# Altium schematic sheet Schem_Analog_2021-08-04.schdoc
size 290 x 200 mm
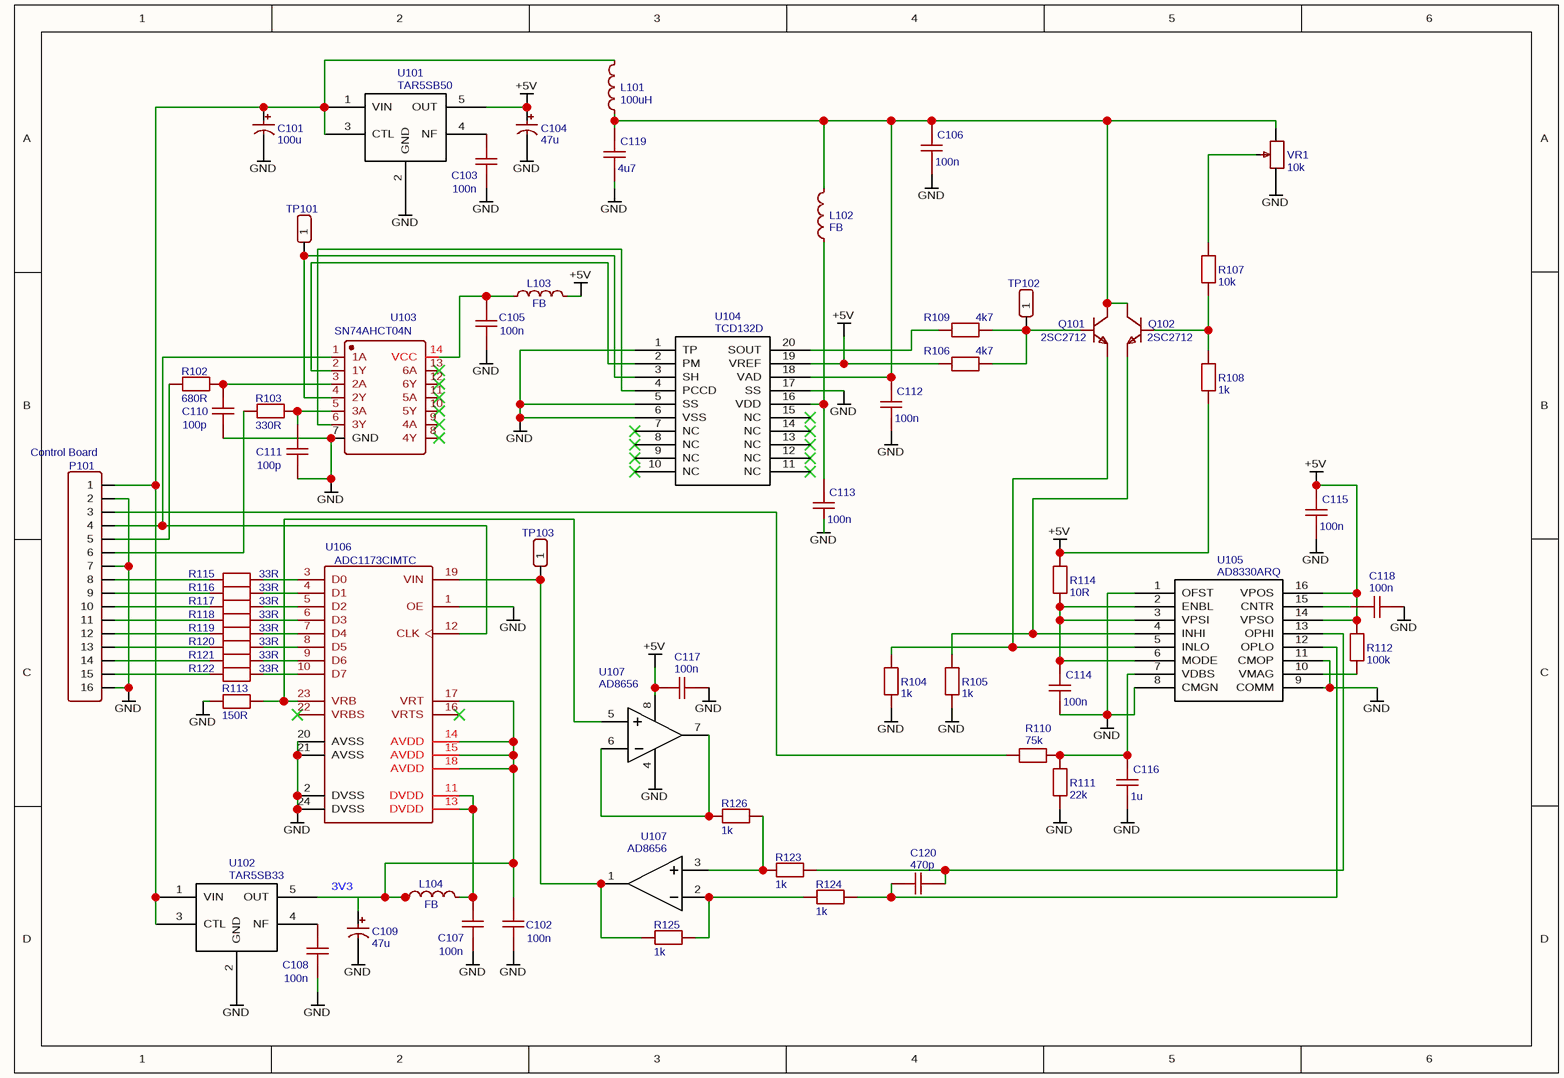
[diagram p0: Schem_Analog_2021-08-04.schdoc]

## Parts
(Parts that share a designator on the sheet are numbered #1, #2 ... from top to bottom, then left to right.)
C101  100u  [CAP-TH_BD5.0-P2.00-D0.8-FD]
C102  100n  [RAD-0.1]
C103  100n  [RAD-0.1]
C104  47u  [CAP-TH_BD5.0-P2.00-D0.8-FD]
C105  100n  [RAD-0.1]
C106  100n  [RAD-0.1]
C107  100n  [RAD-0.1]
C108  100n  [RAD-0.1]
C109  47u  [CAP-TH_BD5.0-P2.00-D0.8-FD]
C110  100p  [RAD-0.1]
C111  100p  [RAD-0.1]
C112  100n  [RAD-0.1]
C113  100n  [RAD-0.1]
C114  100n  [RAD-0.1]
C115  100n  [RAD-0.1]
C116  1u  [RAD-0.1]
C117  100n  [RAD-0.1]
C118  100n  [RAD-0.1]
C119  4u7  [RAD-0.1]
C120  470p  [RAD-0.1]
L101  100uH  [IND-TH_BD8.5-P5.00-D0.6]
L102  FB  [L0603]
L103  FB  [L0603]
L104  FB  [L0603]
P101  Control Board  [HDR-TH_16P-P2.54-V]
Q101  2SC2712  [SOT-23-3_L2.9-W1.6-P1.90-LS2.8-BR]
Q102  2SC2712  [SOT-23-3_L2.9-W1.6-P1.90-LS2.8-BR]
R102  680R  [R_AXIAL-0.3]
R103  330R  [R_AXIAL-0.3]
R104  1k  [R_AXIAL-0.3]
R105  1k  [R_AXIAL-0.3]
R106  4k7  [R_AXIAL-0.3]
R107  10k  [R_AXIAL-0.3]
R108  1k  [R_AXIAL-0.3]
R109  4k7  [R_AXIAL-0.3]
R110  75k  [R_AXIAL-0.3]
R111  22k  [R_AXIAL-0.3]
R112  100k  [R_AXIAL-0.3]
R113  150R  [R_AXIAL-0.3]
R114  10R  [R_AXIAL-0.3]
R115  33R  [R_AXIAL-0.3]
R116  33R  [R_AXIAL-0.3]
R117  33R  [R_AXIAL-0.3]
R118  33R  [R_AXIAL-0.3]
R119  33R  [R_AXIAL-0.3]
R120  33R  [R_AXIAL-0.3]
R121  33R  [R_AXIAL-0.3]
R122  33R  [R_AXIAL-0.3]
R123  1k  [R_AXIAL-0.3]
R124  1k  [R_AXIAL-0.3]
R125  1k  [R_AXIAL-0.3]
R126  1k  [R_AXIAL-0.3]
TP101  HDR-M-2.54_1x1  [HDR-M-2.54_1X1]  (value not drawn)
TP102  HDR-M-2.54_1x1  [HDR-M-2.54_1X1]  (value not drawn)
TP103  HDR-M-2.54_1x1  [HDR-M-2.54_1X1]  (value not drawn)
U101  TAR5SB50  [SOT23-5]
U102  TAR5SB33  [SOT23-5]
U103  SN74AHCT04N  [DIP14]
U104  TCD132D  [WDIP20-G-400(B)]
U105  AD8330ARQ  [AD8330-RQ_16]
U106  ADC1173CIMTC  [TSSOP-24]
U107#1  AD8656  [ADI-R-8_N]
U107#2  AD8656  [ADI-R-8_N]
VR1  10k  [RES-ADJ-TH_3296W]

## Nets
+5V: C104.1 C115.1 C117.1 L103.2 R106.1 R108.1 R112.1 R114.1 U101.5(OUT) U104.19(VREF) U105.14(VPSO) U105.16(VPOS) U107#1.8(+V)
GND: C101.2 C102.2 C103.2 C104.2 C105.2 C106.2 C107.2 C108.2 C109.2 C110.2 C111.2 C112.2 C113.2 C114.2 C115.2 C116.2 C117.2 C118.2 C119.2 P101.2 P101.7 P101.16 R104.2 R105.2 R111.2 R113.2 U101.2(GND) U102.2(GND) U103.7(GND) U104.1(TP) U104.5(SS) U104.6(VSS) U104.17(SS) U105.1(OFST) U105.8(CMGN) U105.9(COMM) U105.11(CMOP) U106.1(OE) U106.2(DVSS) U106.20(AVSS) U106.21(AVSS) U106.24(DVSS) U107#1.4(-V) VR1.3
NetC101_1: C101.1 L101.2 P101.1 U101.1(VIN) U101.3(CTL) U102.1(VIN) U102.3(CTL)
NetC102_1: C102.1 C109.1 L104.1 U102.5(OUT) U106.14(AVDD) U106.15(AVDD) U106.17(VRT) U106.18(AVDD)
NetC103_1: C103.1 U101.4(NF)
NetC105_1: C105.1 L103.1 U103.14(VCC)
NetC106_1: C106.1 C112.1 C119.1 L101.1 L102.2 Q101.3(C) Q102.3(C) U104.18(VAD) VR1.1
NetC107_1: C107.1 L104.2 U106.11(DVDD) U106.13(DVDD)
NetC108_1: C108.1 U102.4(NF)
NetC110_1: C110.1 R102.1 U103.3(2A)
NetC111_1: C111.1 R103.1 U103.5(3A)
NetC113_1: C113.1 L102.1 U104.16(VDD)
NetC114_1: C114.1 R114.2 U105.2(ENBL) U105.3(VPSI) U105.6(MODE)
NetC116_1: C116.1 R110.2 R111.1 U105.7(VDBS)
NetC118_1: C118.1 U105.15(CNTR)
NetC120_1: C120.1 R124.1 U105.12(OPLO)
NetC120_2: C120.2 R123.1 U105.13(OPHI)
NetP101_3: P101.3 R110.1
NetP101_4: P101.4 U103.1(1A) U106.12(CLK)
NetP101_5: P101.5 R102.2
NetP101_6: P101.6 R103.2
NetP101_8: P101.8 R115.2
NetP101_9: P101.9 R116.2
NetP101_10: P101.10 R117.2
NetP101_11: P101.11 R118.2
NetP101_12: P101.12 R119.2
NetP101_13: P101.13 R120.2
NetP101_14: P101.14 R121.2
NetP101_15: P101.15 R122.2
NetQ101_1: Q101.1(B) R106.2 R109.2 TP102.1
NetQ101_2: Q101.2(E) R104.1 U105.5(INLO)
NetQ102_1: Q102.1(B) R107.1 R108.2
NetQ102_2: Q102.2(E) R105.1 U105.4(INHI)
NetR107_2: R107.2 VR1.2
NetR109_1: R109.1 U104.20(SOUT)
NetR112_2: R112.2 U105.10(VMAG)
NetR113_1: R113.1 U106.23(VRB) U107#1.5(+IN_A)
NetR115_1: R115.1 U106.3(D0)
NetR116_1: R116.1 U106.4(D1)
NetR117_1: R117.1 U106.5(D2)
NetR118_1: R118.1 U106.6(D3)
NetR119_1: R119.1 U106.7(D4)
NetR120_1: R120.1 U106.8(D5)
NetR121_1: R121.1 U106.9(D6)
NetR122_1: R122.1 U106.10(D7)
NetR123_2: R123.2 R126.1 U107#2.3(-IN_B)
NetR124_2: R124.2 R125.1 U107#2.2(+IN_B)
NetR125_2: R125.2 TP103.1 U106.19(VIN) U107#2.1(OUT_B)
NetR126_2: R126.2 U107#1.6(-IN_A) U107#1.7(OUT_A)
NetTP101_1: TP101.1 U103.4(2Y) U104.3(SH)
NetU103_2: U103.2(1Y) U104.2(PM)
NetU103_6: U103.6(3Y) U104.4(PCCD)

Not connected (* = marked no-connect by the designer): U103 8(4Y)* 9(4A)* 10(5Y)* 11(5A)* 12(6Y)* 13(6A)*; U104 7(NC)* 8(NC)* 9(NC)* 10(NC)* 11(NC)* 12(NC)* 13(NC)* 14(NC)* 15(NC)*; U106 16(VRTS)* 22(VRBS)*

## Notes on the sheet
- 3V3

## Library data of the parts
C101 = 100u: BOM_Manufacturer: ValuePro; BOM_Manufacturer Part: 47uF 25V 5*11; nameAlias: Capacitance; BOM_Supplier: LCSC; BOM_Supplier Part: C43350; BOM_JLCPCB Part Class: Extended Part; spicePre: C; spiceSymbolName: 47uF 25V 5*11
C102 C103 C105-C108 C112-C115 C117 C118 = 100n: nameAlias: Value(F); Contributor: LCEDA_Lib; spicePre: C; spiceSymbolName: C_RAD-0.1_US
C104 C109 = 47u: BOM_Manufacturer: ValuePro; BOM_Manufacturer Part: 47uF 25V 5*11; nameAlias: Capacitance; BOM_Supplier: LCSC; BOM_Supplier Part: C43350; BOM_JLCPCB Part Class: Extended Part; spicePre: C; spiceSymbolName: 47uF 25V 5*11
C110 C111 = 100p: nameAlias: Value(F); Contributor: LCEDA_Lib; spicePre: C; spiceSymbolName: C_RAD-0.1_US
C116 = 1u: nameAlias: Value(F); Contributor: LCEDA_Lib; spicePre: C; spiceSymbolName: C_RAD-0.1_US
C119 = 4u7: nameAlias: Value(F); Contributor: LCEDA_Lib; spicePre: C; spiceSymbolName: C_RAD-0.1_US
C120 = 470p: nameAlias: Value(F); Contributor: LCEDA_Lib; spicePre: C; spiceSymbolName: C_RAD-0.1_US
L101 = 100uH: BOM_Manufacturer: TE Connectivity; BOM_Manufacturer Part: 5-1624055-5; nameAlias: Inductance; Contributor: LCSC; BOM_Supplier: LCSC; BOM_Supplier Part: C306213; BOM_JLCPCB Part Class: Extended Part; spicePre: L; spiceSymbolName: 5-1624055-5
L102-L104 = FB: BOM_Manufacturer: TDK; BOM_Manufacturer Part: MMZ1608R600ATA00; Contributor: LCSC; BOM_Supplier: LCSC; BOM_Supplier Part: C275447; BOM_JLCPCB Part Class: Extended Part; spicePre: U; spiceSymbolName: MMZ1608R600ATA00
P101 = Control Board: BOM_Manufacturer: BOOMELE; BOM_Manufacturer Part: Female header1*16P pitch 2.54mm; BOM_Supplier: LCSC; BOM_Supplier Part: C66987; BOM_JLCPCB Part Class: Extended Part; spicePre: P; spiceSymbolName: Header-Female-2.54_1x16
Q101 Q102 = 2SC2712: BOM_Manufacturer: CJ; Contributor: LCSC; BOM_Supplier: LCSC; BOM_Manufacturer Part: 2SC2712; BOM_Supplier Part: C112427; BOM_JLCPCB Part Class: Extended Part; spicePre: Q; spiceSymbolName: 2SC2712
R102 = 680R: nameAlias: Value(Ω); Contributor: LCEDA_Lib; spicePre: R; spiceSymbolName: R_AXIAL-0.3_EU
R103 = 330R: nameAlias: Value(Ω); Contributor: LCEDA_Lib; spicePre: R; spiceSymbolName: R_AXIAL-0.3_EU
R104 R105 R108 R123-R126 = 1k: nameAlias: Value(Ω); Contributor: LCEDA_Lib; spicePre: R; spiceSymbolName: R_AXIAL-0.3_EU
R106 R109 = 4k7: nameAlias: Value(Ω); Contributor: LCEDA_Lib; spicePre: R; spiceSymbolName: R_AXIAL-0.3_EU
R107 = 10k: nameAlias: Value(Ω); Contributor: LCEDA_Lib; spicePre: R; spiceSymbolName: R_AXIAL-0.3_EU
R110 = 75k: nameAlias: Value(Ω); Contributor: LCEDA_Lib; spicePre: R; spiceSymbolName: R_AXIAL-0.3_EU
R111 = 22k: nameAlias: Value(Ω); Contributor: LCEDA_Lib; spicePre: R; spiceSymbolName: R_AXIAL-0.3_EU
R112 = 100k: nameAlias: Value(Ω); Contributor: LCEDA_Lib; spicePre: R; spiceSymbolName: R_AXIAL-0.3_EU
R113 = 150R: nameAlias: Value(Ω); Contributor: LCEDA_Lib; spicePre: R; spiceSymbolName: R_AXIAL-0.3_EU
R114 = 10R: nameAlias: Value(Ω); Contributor: LCEDA_Lib; spicePre: R; spiceSymbolName: R_AXIAL-0.3_EU
R115-R122 = 33R: nameAlias: Value(Ω); Contributor: LCEDA_Lib; spicePre: R; spiceSymbolName: R_AXIAL-0.3_EU
TP101-TP103 = HDR-M-2.54_1x1: Contributor: LCEDA_Lib; BOM_Supplier Part: C81276; BOM_Supplier: LCSC; spicePre: J; spiceSymbolName: HDR-M-2.54_1x1
U101 = TAR5SB50: Contributor: prism; Package Display: No; spicePre: U; spiceSymbolName: TAR5SB50
U102 = TAR5SB33: Contributor: prism; spicePre: U; spiceSymbolName: TAR5SB33
U104 = TCD132D: Contributor: prism; spicePre: U; spiceSymbolName: TCD132D
U105 = AD8330ARQ: Contributor: prism; spicePre: U; spiceSymbolName: AD8330ARQ
U106 = ADC1173CIMTC: description: 8-Bit, 3-Volt, 15 MSPS, 33mW AD Converter, 24-pin TSSOP; spicePre: U; spiceSymbolName: ADC1173CIMTC
U107#1 U107#2 = AD8656: BOM_Manufacturer: Analog Devices; subpart_no: 1; Contributor: prism; BOM_Supplier Part: AD8656ARZ-ND; BOM_Supplier: Digi-Key; BOM_Manufacturer Part: AD8656; spicePre: U; spiceSymbolName: AD8656
VR1 = 10k: BOM_Manufacturer: ReliaPro; BOM_Manufacturer Part: 3296W/20ohm; BOM_Supplier Part: C47080; BOM_Supplier: LCSC; spicePre: R; spiceSymbolName: 3296W/20ohm
U103 = SN74AHCT04N: spicePre: X; spiceSymbolName: SN74AHCT04N